# EasyEDA Pro project Board.eprj, schematic Schematic1
Create Date: 2024-07-30; Page Name: Screen_attach; Project Name: Dami; Schematic Name: Schematic1; Update Date: 2024-08-01; Company: EasyEDA.com; Drawn: EasyEDA; Page Size: A4; Part Number: JLCPCB-002; Reviewed: EasyEDA; Version: V0.1
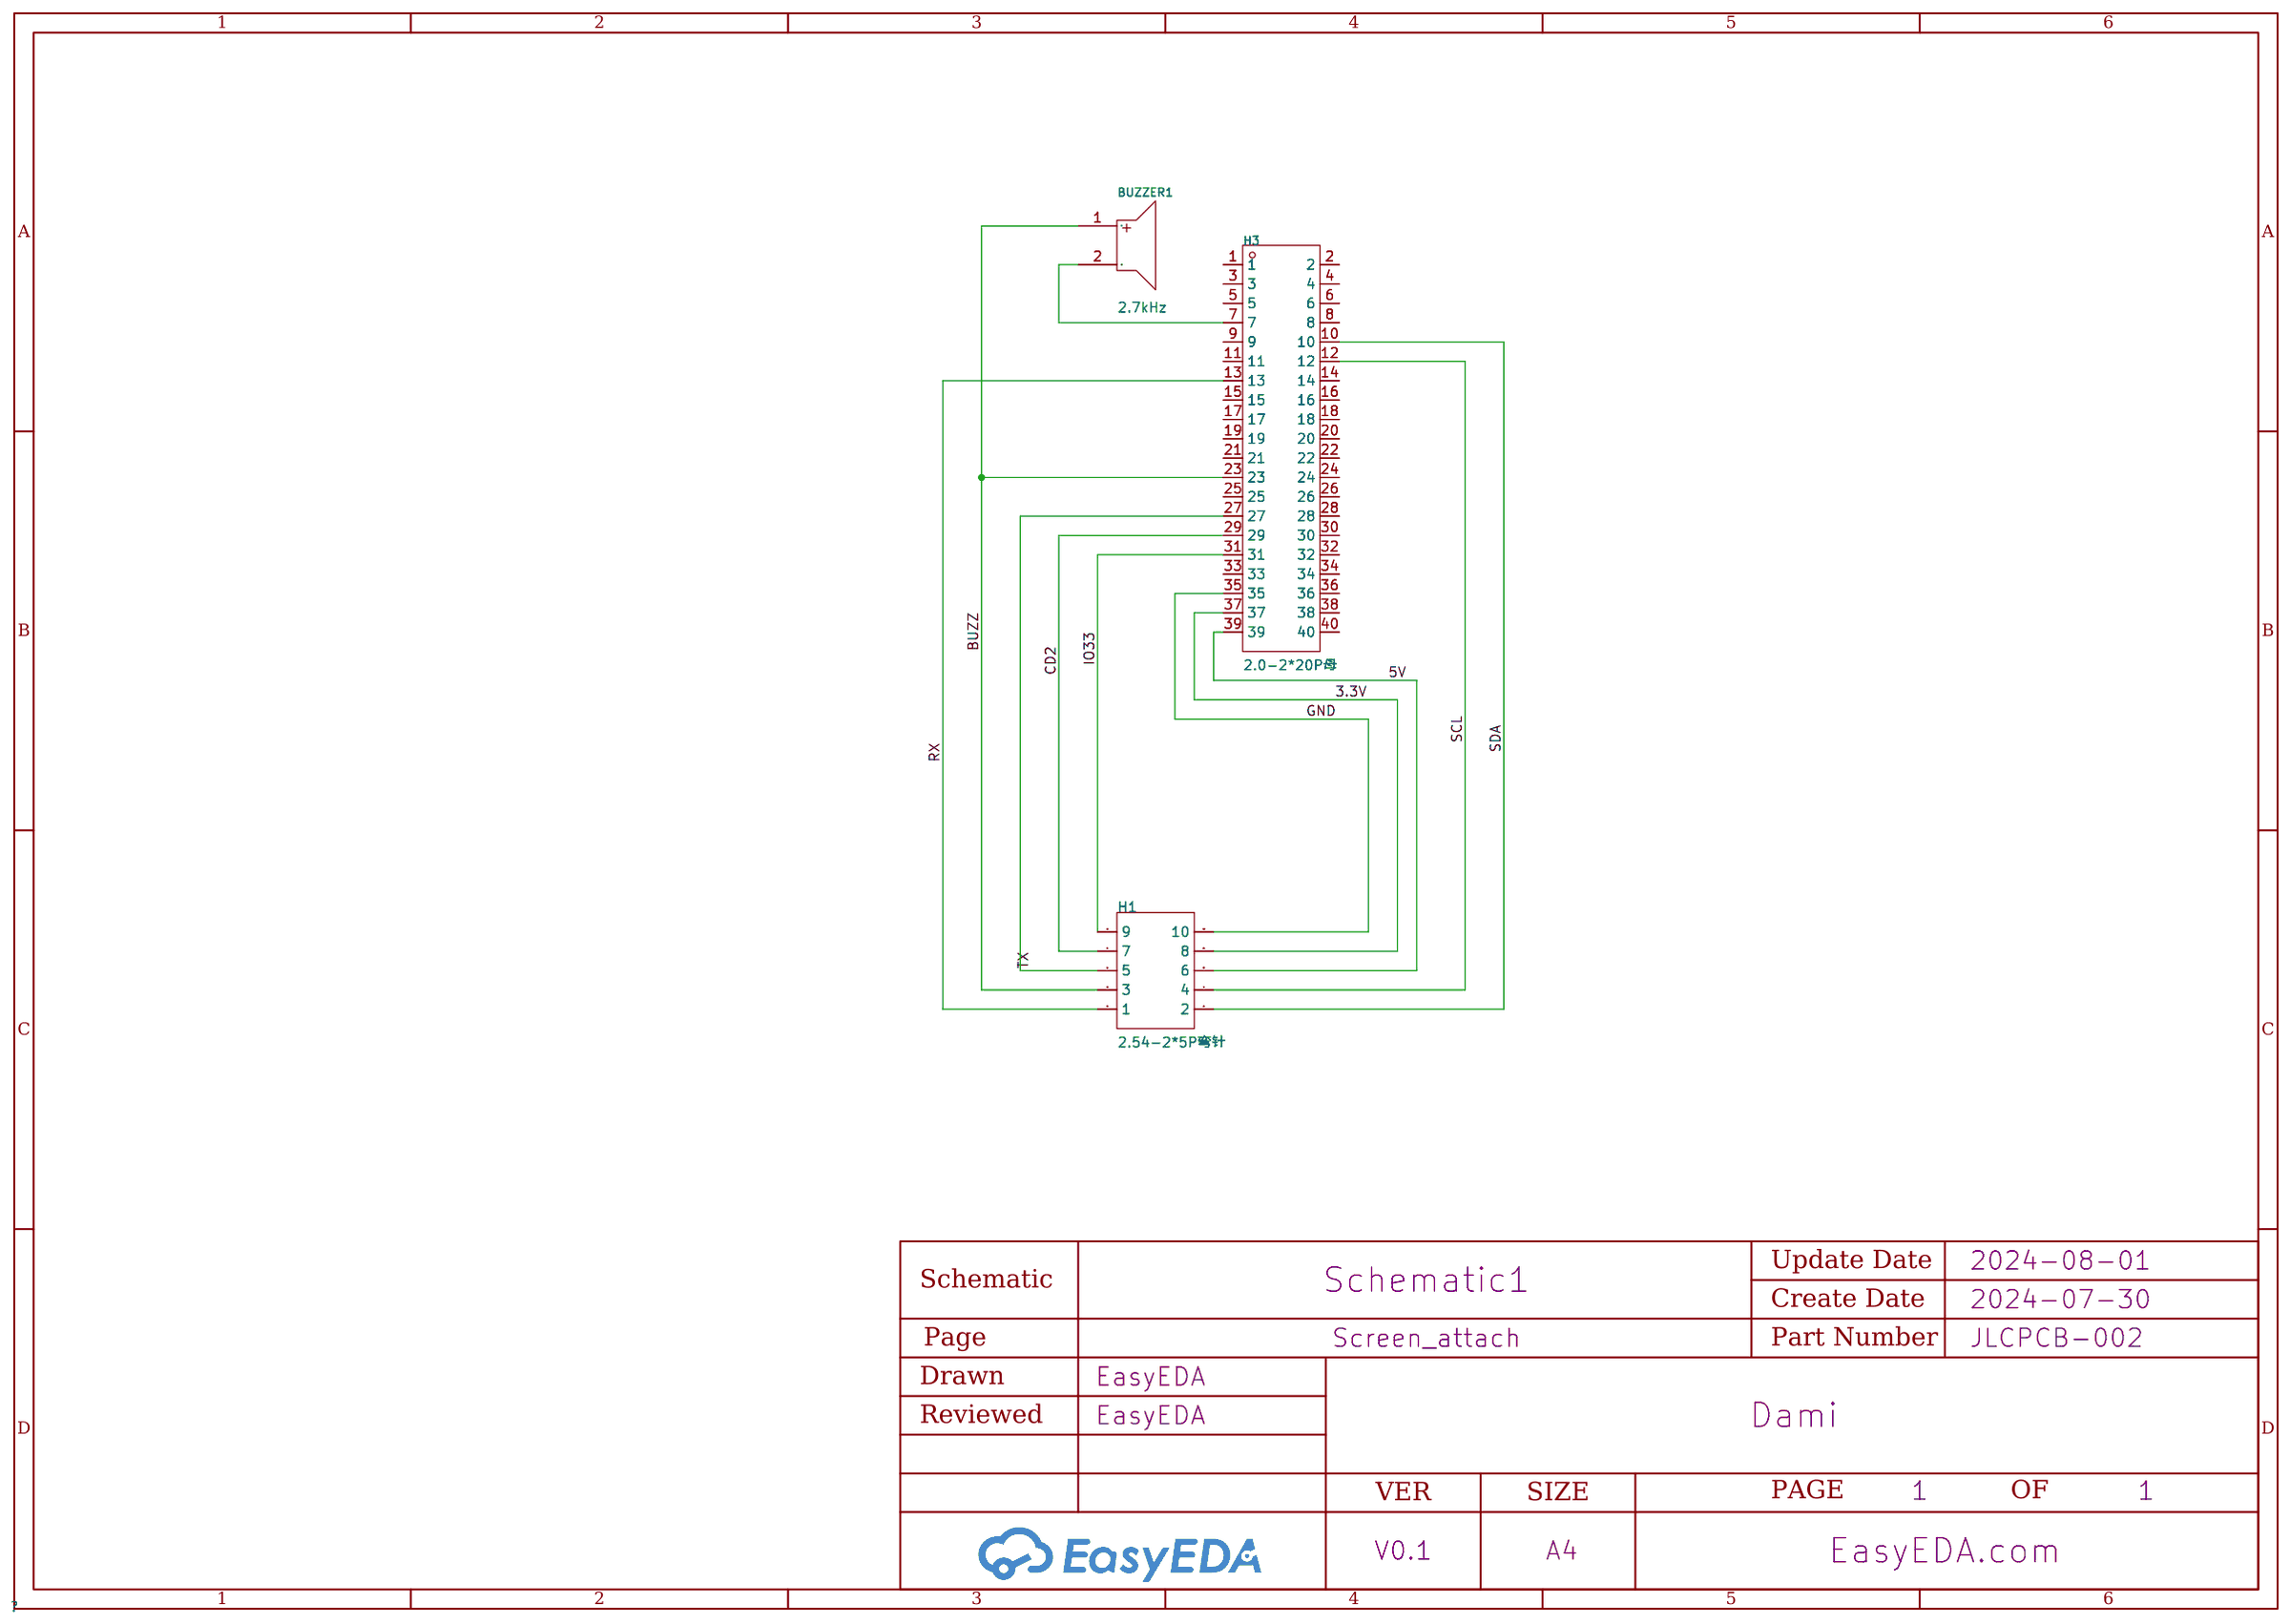
[diagram p0: schematic sheet]

## Parts
BUZZER1  2.7kHz  [BUZ-TH_BD9.0-P4.00-D0.6-FD]
H1  2.54-2*5P弯针  [HDR-TH_10P-P2.54-H-M-R2-C5-S2.54-W12.9]
H3  2.0-2*20P母  [HDR-TH_40P-P2.00-V-F-R2-C20-S2.00]

## Library data of the parts
BUZZER1 = QMB-09B-03: Oscillator Circuit:无源(外部驱动) Technology Type:电磁式 Operating Voltage:2V~5V Operating Voltage:2V~5V Frequency:2.7kHz Sound Pressure Level (SPL):85dB@3V,10cm Diameter (φD):9mm Height:5.7mm; LCSC Part Name: 无源蜂鸣器QMB-09B-03; Supplier Part: C96256; Manufacturer: 华能; Supplier Footprint: 插件,D=9mm; JLCPCB Part Class: Extended Part; Datasheet: https://atta.szlcsc.com/upload/public/pdf/source/20210401/C96256_958B17753B5AD7CBFBCFFC7C095B4484.pdf; Supplier: LCSC; Oscillator Circuit: 无源(外部驱动); Technology Type: 电磁式; Operating Voltage: 2V~5V; Sound Pressure Level (SPL): 85dB@3V,10cm; Diameter (φD): 9mm; Height: 5.7mm
H1 = 2.54-2*5P弯针: Pin Structure:2x5P Pitch:2.54mm Row Spacing:2.54mm Circluar Pins/Square Pins:Square Pins Mounting Type:Right-Angle Number of Rows:双排 Number of Pins:10P Current Rating (Max):3A Voltage Rating (Max):- Length of Mating Pin:6mm Insulation Height:2.54mm Contac; LCSC Part Name: 间距:2.54mm 2x5P 弯插 方针; Supplier Part: C60563; Manufacturer: BOOMELE(博穆精密); Supplier Footprint: 弯插,P=2.54mm; JLCPCB Part Class: Extended Part; Datasheet: https://atta.szlcsc.com/upload/public/pdf/source/20201009/C60563_5FFC87C912161176506B1BF1C101B88D.pdf; Supplier: LCSC; Pin Structure: 2x5P; Pitch: 2.54mm; Row Spacing: 2.54mm; Circluar Pins/Square Pins: Square Pins; Mounting Type: Right-Angle; Number of Rows: 双排; Number of Pins: 10P; Current Rating (Max): 3A; Length of Mating Pin: 6mm; Insulation Height: 2.54mm; Operating Temperature Range: -55℃~+105℃; Color: Black
H3 = 2.0-2*20P母: Holes Structure:- Pitch:2mm Row Spacing:2mm Circular Hole / Square Hole:- Mounting Type:Straight Number of Rows:双排 Number of Holes:40P Current Rating (Max):- Voltage Rating (Max):- Holes Direction:- Insulation Height:- Contact Material:- Contact Plating:-; LCSC Part Name: 间距:2mm 直插; Supplier Part: C110426; Manufacturer: BOOMELE(博穆精密); Supplier Footprint: 插件,P=2mm; JLCPCB Part Class: Extended Part; Datasheet: https://atta.szlcsc.com/upload/public/pdf/source/20230330/72429EBD17B7DF6EF48873C4D9CA2FEF.pdf; Supplier: LCSC; Pitch: 2mm; Row Spacing: 2mm; Mounting Type: Straight; Number of Rows: 双排; Number of Holes: 40P

## Nets
3.3V: H1.8 H3.37
5V: H1.6 H3.39
GND: BUZZER1.2 H1.10 H3.7 H3.35
BUZZ: BUZZER1.1 H1.3 H3.23
CD2: H1.7 H3.29
IO33: H1.9 H3.31
RX: H1.1 H3.13
SCL: H1.4 H3.12
SDA: H1.2 H3.10
TX: H1.5 H3.27

Not connected (* = marked no-connect by the designer): H3 1 2 3 4 5 6 8 9 11 14 15 16 17 18 19 20 21 22 24 25 26 28 30 32 33 34 36 38 40
